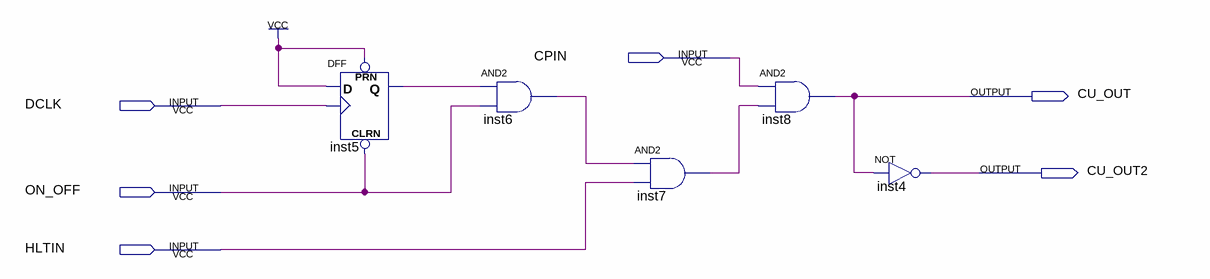
[diagram p0: schematic sheet]
// Quartus schematic Cont.bdf as structural Verilog: 5 symbols, 6 pins
module Cont (
  input  CPIN,
  input  DCLK,
  input  ON_OFF,
  input  HLTIN,
  output CU_OUT,
  output CU_OUT2
);

  wire inst5_q, inst6_out, inst7_out;

  DFF inst5 (.CLRN(ON_OFF), .CLK(DCLK), .D(1'b1), .PRN(1'b1), .Q(inst5_q));
  and inst6 (inst6_out, inst5_q, ON_OFF);
  and inst7 (inst7_out, inst6_out, HLTIN);
  and inst8 (CU_OUT, CPIN, inst7_out);
  not inst4 (CU_OUT2, CU_OUT);
endmodule
